# Altium schematic sheet bridge.SchDoc
size A1; SheetNumber: 2; SheetTotal: 5
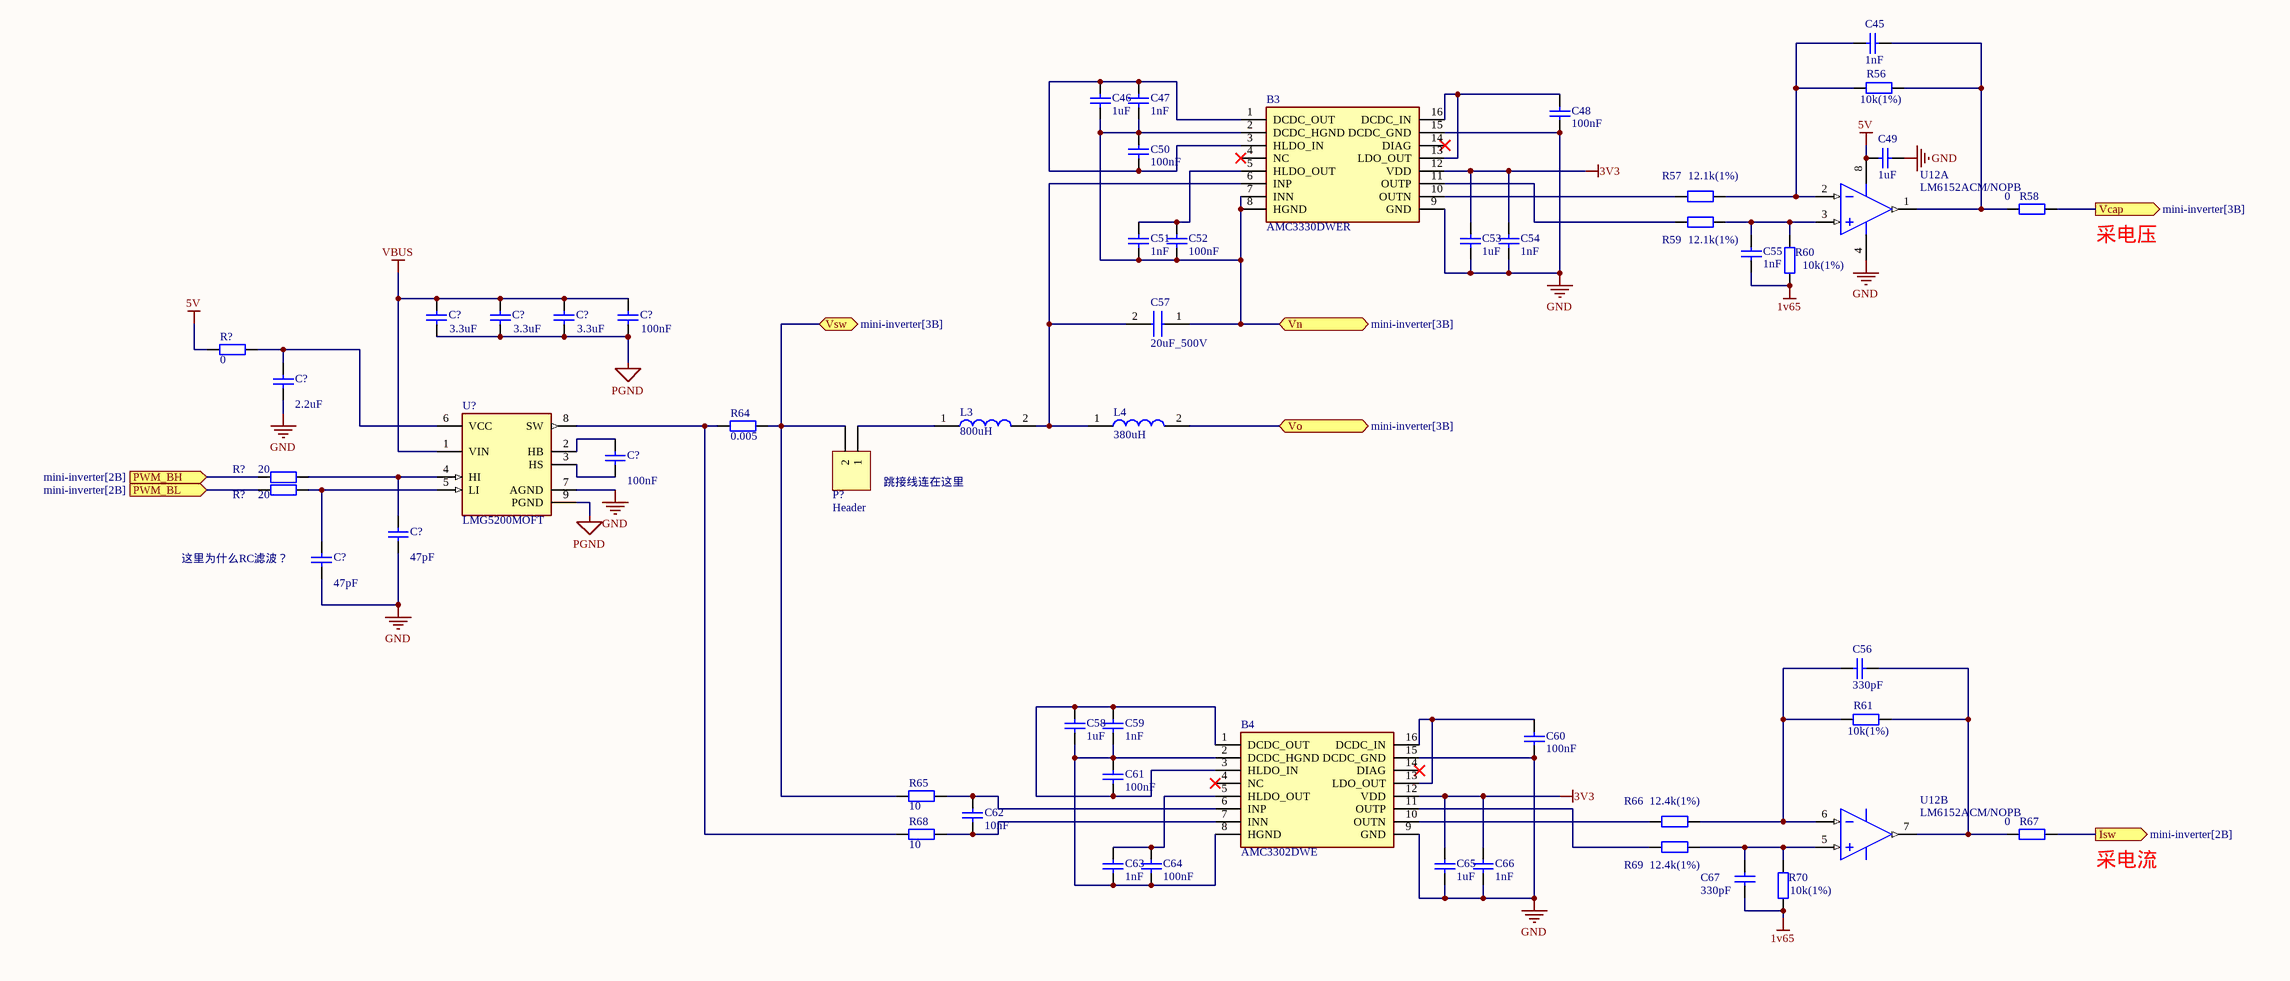
[diagram p0: bridge.SchDoc]

## Parts
(Parts that share a designator on the sheet are numbered #1, #2 ... from top to bottom, then left to right.)
B3  AMC3330DWER  [SOIC127P1030X265-16N]
B4  AMC3302DWE  [SOIC127P1030X265-16N]
C45  1nF  [CAPC1608X06N]
C46  1uF  [CAPC1608X06N]
C47  1nF  [CAPC1608X06N]
C48  100nF  [CAPC1608X06N]
C49  1uF  [CAPC1608X06N]
C50  100nF  [CAPC1608X06N]
C51  1nF  [CAPC1608X06N]
C52  100nF  [CAPC1608X06N]
C53  1uF  [CAPC1608X06N]
C54  1nF  [CAPC1608X06N]
C55  1nF  [CAPC1608X06N]
C56  330pF  [CAPC1608X06N]
C57  20uF_500V  [Film Capacitor PHE450HF7220JR06L2]
C58  1uF  [CAPC1608X06N]
C59  1nF  [CAPC1608X06N]
C60  100nF  [CAPC1608X06N]
C61  100nF  [CAPC1608X06N]
C62  10nF  [CAPC1608X06N]
C63  1nF  [CAPC1608X06N]
C64  100nF  [CAPC1608X06N]
C65  1uF  [CAPC1608X06N]
C66  1nF  [CAPC1608X06N]
C67  330pF  [CAPC1608X06N]
C?#1  100nF  [CAPC1608X06N]
C?#2  3.3uF  [CAPC1608X06N]
C?#3  3.3uF  [CAPC1608X06N]
C?#4  3.3uF  [CAPC1608X06N]
C?#5  2.2uF  [CAPC1608X06N]
C?#6  100nF  [CAPC1608X06N]
C?#7  47pF  [CAPC1608X06N]
C?#8  47pF  [CAPC1608X06N]
L3  800uH  [4mH Custom]
L4  380uH  [380uH Custom]
P?  Header  [HDR1X2]
R56  10k(1%)  [RESC1608X05N]
R57  12.1k(1%)  [RESC1608X05N]
R58  0  [RESC1608X05N]
R59  12.1k(1%)  [RESC1608X05N]
R60  10k(1%)  [RESC1608X05N]
R61  10k(1%)  [RESC1608X05N]
R64  0.005  [RESC1608X05N]
R65  10  [RESC1608X05N]
R66  12.4k(1%)  [RESC1608X05N]
R67  0  [RESC1608X05N]
R68  10  [RESC1608X05N]
R69  12.4k(1%)  [RESC1608X05N]
R70  10k(1%)  [RESC1608X05N]
R?#1  0  [RESC1608X05N]
R?#2  20  [RESC1608X05N]
R?#3  20  [RESC1608X05N]
U12  LM6152ACM/NOPB  [D0008A_L]  (parts A,B of 2)
U?  LMG5200MOFT  [FP-MOF0009A-MFG]

## Ports
Isw (out, see mini-inverter[2B]), PWM_BH (in, see mini-inverter[2B]), PWM_BL (in, see mini-inverter[2B]), Vcap (out, see mini-inverter[3B]), Vn (bidir, see mini-inverter[3B]), Vo (bidir, see mini-inverter[3B]), Vsw (bidir, see mini-inverter[3B])

## Nets
1v65: C55.1 C67.1 R60.1 R70.1
3V3: B3.12(VDD) B4.12(VDD) C53.1 C54.1 C65.1 C66.1
5V: C49.2 R?#1.2 U12.8(V+)
GND: B3.9(GND) B3.15(DCDC_GND) B4.9(GND) B4.15(DCDC_GND) C48.2 C49.1 C53.2 C54.2 C60.2 C65.2 C66.2 C?#5.1 C?#7.2 C?#8.2 U12.4(V-) U?.7(AGND)
PGND: C?#1.2 C?#2.1 C?#3.1 C?#4.1 U?.9(PGND)
VBUS: C?#1.1 C?#2.2 C?#3.2 C?#4.2 U?.1(VIN)
Isw: R67.1 ; port Isw
PWM_BH: R?#2.2 ; port PWM_BH
PWM_BL: R?#3.2 ; port PWM_BL
Vcap: R58.1 ; port Vcap
Vn: B3.2(DCDC_HGND) B3.7(INN) B3.8(HGND) C46.2 C47.2 C50.1 C51.2 C52.2 C57.1 ; port Vn
Vo: L4.2 ; port Vo
Vsw: P?.2 R64.2 R65.1 ; port Vsw
NetB3_1: B3.1(DCDC_OUT) B3.3(HLDO_IN) C46.1 C47.1 C50.2
NetB3_5: B3.5(HLDO_OUT) C51.1 C52.1
NetB3_6: B3.6(INP) C57.2 L3.2 L4.1
NetB3_10: B3.10(OUTN) R57.2
NetB3_11: B3.11(OUTP) R59.1
NetB3_13: B3.13(LDO_OUT) B3.16(DCDC_IN) C48.1
NetB4_1: B4.1(DCDC_OUT) B4.3(HLDO_IN) C58.1 C59.1 C61.2
NetB4_2: B4.2(DCDC_HGND) B4.8(HGND) C58.2 C59.2 C61.1 C63.2 C64.2
NetB4_5: B4.5(HLDO_OUT) C63.1 C64.1
NetB4_6: B4.6(INP) C62.1 R65.2
NetB4_7: B4.7(INN) C62.2 R68.2
NetB4_10: B4.10(OUTN) R66.2
NetB4_11: B4.11(OUTP) R69.1
NetB4_13: B4.13(LDO_OUT) B4.16(DCDC_IN) C60.1
NetC45_1: C45.1 R56.1 R58.2 U12.1(OUTA)
NetC45_2: C45.2 R56.2 R57.1 U12.2(INA-)
NetC55_2: C55.2 R59.2 R60.2 U12.3(INA+)
NetC56_1: C56.1 R61.1 R67.2 U12.7(OUTB)
NetC56_2: C56.2 R61.2 R66.1 U12.6(INB-)
NetC67_2: C67.2 R69.2 R70.2 U12.5(INB+)
NetC?#5_2: C?#5.2 R?#1.1 U?.6(VCC)
NetC?#6_1: C?#6.1 U?.2(HB)
NetC?#6_2: C?#6.2 U?.3(HS)
NetC?#7_1: C?#7.1 R?#2.1 U?.4(HI)
NetC?#8_1: C?#8.1 R?#3.1 U?.5(LI)
NetL3_1: L3.1 P?.1
NetR64_1: R64.1 R68.1 U?.8(SW)

Not connected (* = marked no-connect by the designer): B3 4(NC)* 14(DIAG)*; B4 4(NC)* 14(DIAG)*

## Notes on the sheet
- 采电压
- (near P?) 跳接线连在这里
- 这里为什么RC滤波？
- 采电流

## Library data of the parts
B3 = AMC3330DWER: Isolation Amplifiers +/-1-V input, precision reinforced isolated amplifier with integrated DC/DC converter and high CMTI 16-SOIC -40 to 125; Manufacturer_Name: Texas Instruments; Geometry.Height: 2.65mm; Manufacturer_Part_Number: AMC3330DWER; Mouser Part Number: 595-AMC3330DWER; Mouser Price/Stock: https://www.mouser.co.uk/ProductDetail/Texas-Instruments/AMC3330DWER?qs=zW32dvEIR3u5qLqnY17MoA%3D%3D; Arrow Part Number: AMC3330DWER; Arrow Price/Stock: https://www.arrow.com/en/products/amc3330dwer/texas-instruments?region=nac; Datasheet Link: https://www.ti.com/lit/ds/symlink/amc3330.pdf?ts=1627904955935&ref_url=https%253A%252F%252Fwww.ti.com%252Fproduct%252FAMC3330
B4 = AMC3302DWE: Isolation Amplifiers +/-50-mV input, precision reinforced isolated amplifier with integrated DC/DC converter 16-SOIC -40 to 125; Manufacturer_Name: Texas Instruments; Geometry.Height: 2.65mm; Manufacturer_Part_Number: AMC3302DWE; Mouser Part Number: 595-AMC3302DWE; Mouser Price/Stock: https://www.mouser.co.uk/ProductDetail/Texas-Instruments/AMC3302DWE?qs=DRkmTr78QAT3OfY8Rd%252BeWA%3D%3D; Arrow Part Number: AMC3302DWE; Arrow Price/Stock: https://www.arrow.com/en/products/amc3302dwe/texas-instruments?region=nac; Datasheet Link: https://www.ti.com/lit/ds/symlink/amc3302.pdf?ts=1643366130509
C45-C56 C58-C67 C?#1-C?#8 = Cap: Capacitor; Published: 8-Jun-2000; LatestRevisionDate: 17-Jul-2002; LatestRevisionNote: Re-released for DXP Platform.; PackageReference: RAD-0.3; Publisher: Altium Limited; PackageDescription: Radial Cap, Thru-Hole; 2 Leads; 0.3 in Pin Spacing
  C45 C47 C51 C54 C55 C59 C63 C66: Value: 1nF
  C46 C49 C53 C58 C65: Value: 1uF
  C48 C50 C52 C60 C61 C64 C?#1 C?#6: Value: 100nF
  C56 C67: Value: 330pF
  C62: Value: 10nF
  C?#2-C?#4: Value: 3.3uF
  C?#5: Value: 2.2uF
  C?#7 C?#8: Value: 47pF
C57 = PHE450HF7220JR06L2: KEMET PHE450 Metallised Polypropylene Film Capacitor, 180 V ac, 250 V dc, ±5%, 2.2μF, Through Hole; Datasheet Link: https://docs.rs-online.com/a458/0900766b817170df.pdf; Height: 24.5mm; Manufacturer_Name: KEMET; Manufacturer_Part_Number: PHE450HF7220JR06L2
L3 = 4mH Custom Inductor
L4 = 380uH Custom Inductor
P? = Header 2: Header, 2-Pin; LatestRevisionDate: 17-Jul-2002; LatestRevisionNote: Re-released for DXP Platform.; Publisher: Altium Limited
R56-R61 R66 R67 R69 R70 = Res2: Resistor; Published: 8-Jun-2000; LatestRevisionDate: 17-Jul-2002; LatestRevisionNote: Re-released for DXP Platform.; PackageReference: AXIAL-0.4; Publisher: Altium Limited; PackageDescription: Axial Device, Thru-Hole; 2 Leads; 0.4 in Pin Spacing
  R56 R60 R61 R70: Value: 10k(1%)
  R57 R59: Value: 12.1k(1%)
  R58 R67: Value: 0
  R66 R69: Value: 12.4k(1%)
R64 R65 R68 R?#1-R?#3 = 0603 100KΩ (1003) 1%_4: 贴片电阻; Value: 1MΩ(1%); ComponentLink1Description: 供应商链接; ComponentLink1URL: http://www.szlcsc.com/product/details_26546.html; Package: 0603; Supplier: LC; SuppliersPartNumber: C25803
U12 = LM6152ACM/NOPB: Dual and Quad 75 MHz GBW Rail-to-Rail I/O Operational Amplifiers, 8-pin Narrow SOIC, Pb-Free; Manufacturer: Texas Instruments; PackageTopMarking: NSZXTT*LM61*52ACM; PowerWise: Y; Package Reference: D0008A; Code_JEDEC: MS-012-AA; Code_IPC: SOIC127P600-8; PinCount: 8; ComponentLink1URL: http://www.ti.com/general/docs/lit/getliterature.tsp?genericPartNumber=LM6152&fileType=pdf; PackageDescription: SOIC Narrow, 4.9 x 3.9 x 1.45mm, 8 Lead, 1.27mm Pitch; CompType: Amplifiers; RoHS: Y; ComponentLink1Description: Datasheet URL
U? = CMP-04912-000022-2: None; Output Current per Channel: 10A; Interface: Logic; Min Operating Temperature: -40°C; Mount: Surface Mount; Case/Package: QFN; RoHS Compliant: Yes; Packaging: Cut Tape; Max Operating Temperature: 125°C; Number of Pins: 9